# EAGLE design LMR62014_3V7to5V_compact (EAGLE 9.6.0)
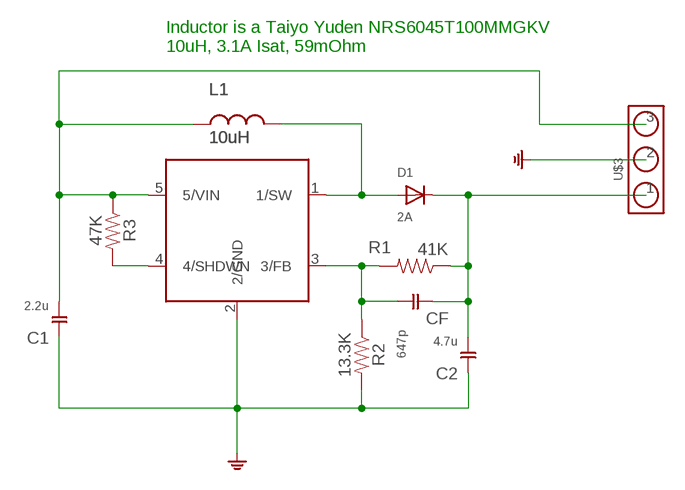
[diagram p0: schematic, sheet 1]

## Parts
C1  2.2u  CAP_0603  [0603_NORMAL]
C2  4.7u  CAP_0603  [0603_NORMAL]
CF  647p  CAP_0603  [0603_NORMAL]
D1  2A  DIODE_SOD-123FL  [SOD-123FL]
L1  10uH  INDUCTOR_SMALL  [INDUCTOR_SMALL]
R1  41K  RESISTOR_0603_TYPICAL  [0603_NORMAL]
R2  13.3K  RESISTOR_0603_TYPICAL  [0603_NORMAL]
R3  47K  RESISTOR_0603_TYPICAL  [0603_NORMAL]
U$1  LMR62014  [SOT23-5]
U$3  HEADER_1X32.54  [1X3_.1"_2.54MM]

## Nets
GND: C1.1 C2.1 R2.2 U$1.2(2/GND) U$3.2
N$1: CF.2 R1.2 R2.1 U$1.3(3/FB)
N$2: D1.A L1.P$2 U$1.1(1/SW)
N$5: C2.2 CF.1 D1.C R1.1 U$3.1
N$6: R3.2 U$1.4(4/SHDWN)
VIN: C1.2 L1.P$1 R3.1 U$1.5(5/VIN) U$3.3

## Notes on the sheet
- Inductor is a Taiyo Yuden NRS6045T100MMGKV 
  10uH, 3.1A Isat, 59mOhm

## Library data of the parts
C1 = RonanLibrary:CAP_0603; PN: TMK212BJ225KGHT
C2 = RonanLibrary:CAP_0603; PN: TMK212BBJ475KD-T
CF = RonanLibrary:CAP_0603; PN: CC0603JRX7R9BB681
D1 = RonanLibrary:DIODE; PN: CRS06(TE85L,Q,M)
L1 = RonanLibrary:INDUCTOR; PN: NRS6045T100MMGKV
R1 = RonanLibrary:RESISTOR_0603; PN: RMCF0603FT41K2
R2 = RonanLibrary:RESISTOR_0603; PN: RMCF0603FT13K3
R3 = RonanLibrary:RESISTOR_0603; PN: RMCF0603JT47K0
U$1 = RonanLibrary:LMR62014; PN: LMR62014XMF/NOPB
U$3 = RonanLibrary:HEADER_1X3

## Board
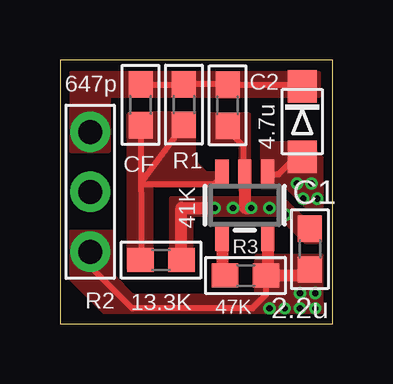
[diagram p1: board, top side]
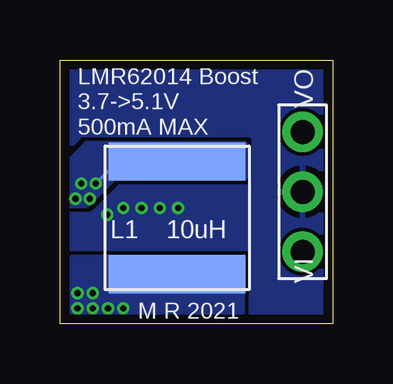
[diagram p2: board, bottom side, seen from below]

Size 11.37 x 11 mm. Coordinates in mm from the lower left corner, seen from the top.
Outline: 0,0 11.37,0 11.37,11 0,11 0,0
Copper layers (1*16): Top 0.035559375mm / dielectric 1.6mm / Bottom 0.035559375mm
Design rules "oshpark-2layer *": minimum track width 6mil, minimum drill 10mil, track to track 6mil, track to pad 6mil, pad to pad 6mil, via to via 6mil, smd to smd 6mil, copper to edge 15mil, drill to drill 6mil, minimum pad ring 5mil, minimum via ring 5mil, stop-mask expansion 2.5mil, vias tented up to drill 15mil, thermal gap 10mil

### Footprints (pad centres in the part's own frame; a part is rotated, then mirrored left to right if it is on the bottom)
0603_NORMAL = smd 1.1 x 1: 1 -0.85,0; 2 0.85,0
SOD-123FL = smd 1.35 x 1.22: A 1.462,0; C -1.462,0
INDUCTOR_SMALL = smd 1.6 x 5.7: P$1 -2.35,0; P$2 2.35,0
SOT23-5 = smd 0.55 x 1.2: 1 -0.95,-1.3; 2 0,-1.3; 3 0.95,-1.3; 4 0.95,1.3; 5 -0.95,1.3
1X3_.1"_2.54MM = drill 1 pad 1.676: 1 -2.5,0; 2 0,0; 3 2.5,0

### Placement (x,y rotation side)
C1  10.41,3.11 270 top
C2  6.98,9.1 90 top
CF  3.36,9.12 270 top
D1  10.09,8.43 270 top
L1  6.49,4.41 90 bottom
R1  5.16,9.14 270 top
R2  4.21,2.65 0 top
R3  7.73,2.01 180 top
U$1  7.7,4.94 180 top
U$3  1.26,5.5 270 top

### Tracks (layer width: path | path; a pad name or v marks a point on that pad's centre or on a via)
GND  (via drill 0.25)
  Top 0.254: C2.1 6.98,8.07 7.64,7.42 7.64,6.3 U$1.2
  Top 0.508: R2.2 5.06,4.83 v6.45,4.83 | U$1.2 7.7,4.83 v7.97,4.83
  other vias: 7.21,4.83 8.73,4.83 9.4,4.54
  pour Top (no thermals): 7.85,5.56 7.85,8.68 6.32,8.68 6.32,7.63 7.55,7.63 7.55,5.56
  pour Top (no thermals): 4.67,2.29 4.67,5.21 9.24,5.21 10.13,4.32 10.76,4.32 10.76,3.43 10.25,3.43 9.11,4.57 5.43,4.57 5.43,2.29
  pour Bottom (rank 2): -0.79,11.43 11.91,11.43 11.91,-0.64 -0.79,-0.64
N$1
  Top 0.152: U$1.3 6.42,5.91 6.42,5.81 | CF.2 3.39,8.24 3.39,5.88
  Top 0.254: 6.42,5.81 3.39,5.81 | 3.39,5.88 R1.2 | CF.2 3.4,2.65 R2.1
  pour Top (no thermals): 6.57,6.22 6.06,6.22 5.56,6.73 5.56,8.71 2.89,8.71 2.89,2.29 3.78,2.29 3.78,5.84 6.57,5.84
N$2  (via drill 0.25)
  Top 0.254: D1.A 9.85,6.97 9.12,6.24 U$1.1
  Bottom 0.152: L1.P$2 8.96,6.76 v9.87,5.84
  other vias: 10.48,5.84 10.13,5.21 10.72,5.21
  pour Bottom (no thermals): 3.65,7.49 10.25,7.49 11.14,6.6 11.14,4.95 10.25,4.95 9.11,6.1 3.65,6.1
  pour Top (no thermals): 8.48,5.71 8.48,7.49 10.25,7.49 11.02,6.73 11.02,4.95 10.25,4.95 9.49,5.71
N$5
  Top 0.254: CF.1 5.15,9.97 R1.1 6.95,9.99 C2.2 10.03,9.95 D1.C
  pour Top (no thermals): 10.76,10.41 0.48,10.41 0.48,7.24 2,7.24 2,9.55 10.76,9.55
N$6
  Top 0.254: 6.88,1.85 R3.2
  Top 0.508: 6.88,1.85 6.75,1.99 U$1.4
VIN  (via drill 0.25)
  Top 0.254: R3.1 8.58,1.2 8.02,0.64 3.02,0.64 1.26,2.39 U$3.3
  Top 0.508: C1.2 10.16,2.01 R3.1 8.65,2.07 U$1.5
  other vias: 8.73,0.64 10,1.27 10.64,1.27 10.64,0.64 10,0.64 9.37,0.64
  pour Top (no thermals): 8.22,2.79 10.89,2.79 10.89,0.51 1.87,0.51 0.48,1.91 0.48,3.81 2.13,3.81 2.13,2.03 3.02,1.14 8.22,1.14
  pour Bottom (no thermals): 3.76,2.75 10.87,2.75 10.87,0.51 3.76,0.51

### Text on the board
bNames: VI VO | LMR62014 Boost / 3.7->5.1V / 500mA MAX | M R 2021